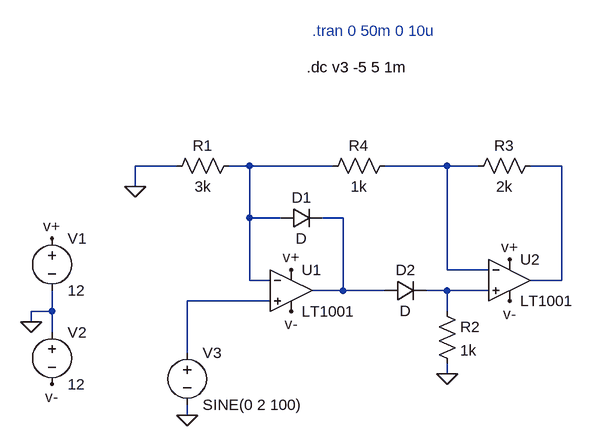
[diagram p0: schematic rect_preci13.asc]
rect_preci13.asc, the LTspice schematic file:
Version 4
SHEET 1 880 680
WIRE -32 0 -96 0
WIRE 80 0 48 0
WIRE 208 0 80 0
WIRE 384 0 288 0
WIRE 432 0 384 0
WIRE 560 0 512 0
WIRE -96 32 -96 0
WIRE 80 80 80 0
WIRE 128 80 80 80
WIRE 224 80 192 80
WIRE 384 160 384 0
WIRE 448 160 384 160
WIRE 80 176 80 80
WIRE 112 176 80 176
WIRE 560 176 560 0
WIRE 560 176 512 176
WIRE 224 192 224 80
WIRE 224 192 176 192
WIRE 288 192 224 192
WIRE 384 192 352 192
WIRE 448 192 384 192
WIRE 112 208 -16 208
WIRE -224 224 -224 192
WIRE -224 224 -256 224
WIRE 384 224 384 192
WIRE -256 240 -256 224
WIRE -224 256 -224 224
WIRE -16 288 -16 208
WIRE 384 320 384 304
WIRE -16 384 -16 368
FLAG -256 240 0
FLAG -224 112 v+
FLAG 144 160 v+
FLAG 480 144 v+
FLAG -224 336 v-
FLAG 144 224 v-
FLAG 480 208 v-
FLAG -16 384 0
FLAG -96 32 0
FLAG 384 320 0
SYMBOL OpAmps\\LT1001 144 128 R0
SYMATTR InstName U1
SYMBOL OpAmps\\LT1001 480 112 R0
SYMATTR InstName U2
SYMBOL voltage -224 96 R0
WINDOW 123 0 0 Left 0
WINDOW 39 0 0 Left 0
SYMATTR InstName V1
SYMATTR Value 12
SYMBOL voltage -224 240 R0
WINDOW 123 0 0 Left 0
WINDOW 39 0 0 Left 0
SYMATTR InstName V2
SYMATTR Value 12
SYMBOL diode 128 96 R270
WINDOW 0 32 32 VTop 2
WINDOW 3 0 32 VBottom 2
SYMATTR InstName D1
SYMBOL diode 288 208 R270
WINDOW 0 32 32 VTop 2
WINDOW 3 0 32 VBottom 2
SYMATTR InstName D2
SYMBOL res 64 -16 R90
WINDOW 0 0 56 VBottom 2
WINDOW 3 32 56 VTop 2
SYMATTR InstName R1
SYMATTR Value 3k
SYMBOL voltage -16 272 R0
WINDOW 123 0 0 Left 0
WINDOW 39 0 0 Left 0
SYMATTR InstName V3
SYMATTR Value SINE(0 2 100)
SYMBOL res 368 208 R0
SYMATTR InstName R2
SYMATTR Value 1k
SYMBOL res 528 -16 R90
WINDOW 0 0 56 VBottom 2
WINDOW 3 32 56 VTop 2
SYMATTR InstName R3
SYMATTR Value 2k
SYMBOL res 304 -16 R90
WINDOW 0 0 56 VBottom 2
WINDOW 3 32 56 VTop 2
SYMATTR InstName R4
SYMATTR Value 1k
TEXT 168 -152 Left 2 !.dc v3 -5 5 1m
TEXT 176 -208 Left 2 ;.tran 0 50m 0 10u

The netlist it stands for:
* rect_preci13.asc
XU1 N006 N001 v+ v- N004 LT1001  ; pins In+ In- V+ V- OUT
XU2 N005 N002 v+ v- N003 LT1001  ; pins In+ In- V+ V- OUT
V1 v+ 0 12
V2 0 v- 12
D1 N001 N004 D
D2 N004 N005 D
R1 N001 0 3k
V3 N006 0 SINE(0 2 100)
R2 N005 0 1k
R3 N003 N002 2k
R4 N002 N001 1k
.model D D
.lib standard.dio
.dc v3 -5 5 1m
* .tran 0 50m 0 10u
.lib LTC.lib
.backanno
.end